# Altium schematic sheet 3_FPGA.SchDoc: AX301  Http://www.heijin.org
size OrCAD A; DocumentNumber: 3; Revision: 1.0; SheetNumber: 3; SheetTotal: 7; PageSetup: Record=PageOptions|CenterHorizontal=True|CenterVertical=True|PrintScale=1.03|XCorrection=1.00|YCorrection=1.00|PrintKind=0|BorderSize=5000000|LeftOffset=0|BottomOffset=0|Orientation=2|PaperLength=1000|PaperWidth=1000|Scale=100|PaperSource=7|PrintQuality=-4|MediaType=1|DitherType=10|PrintScaleMode=1|PaperKind=A4|PaperIndex=9
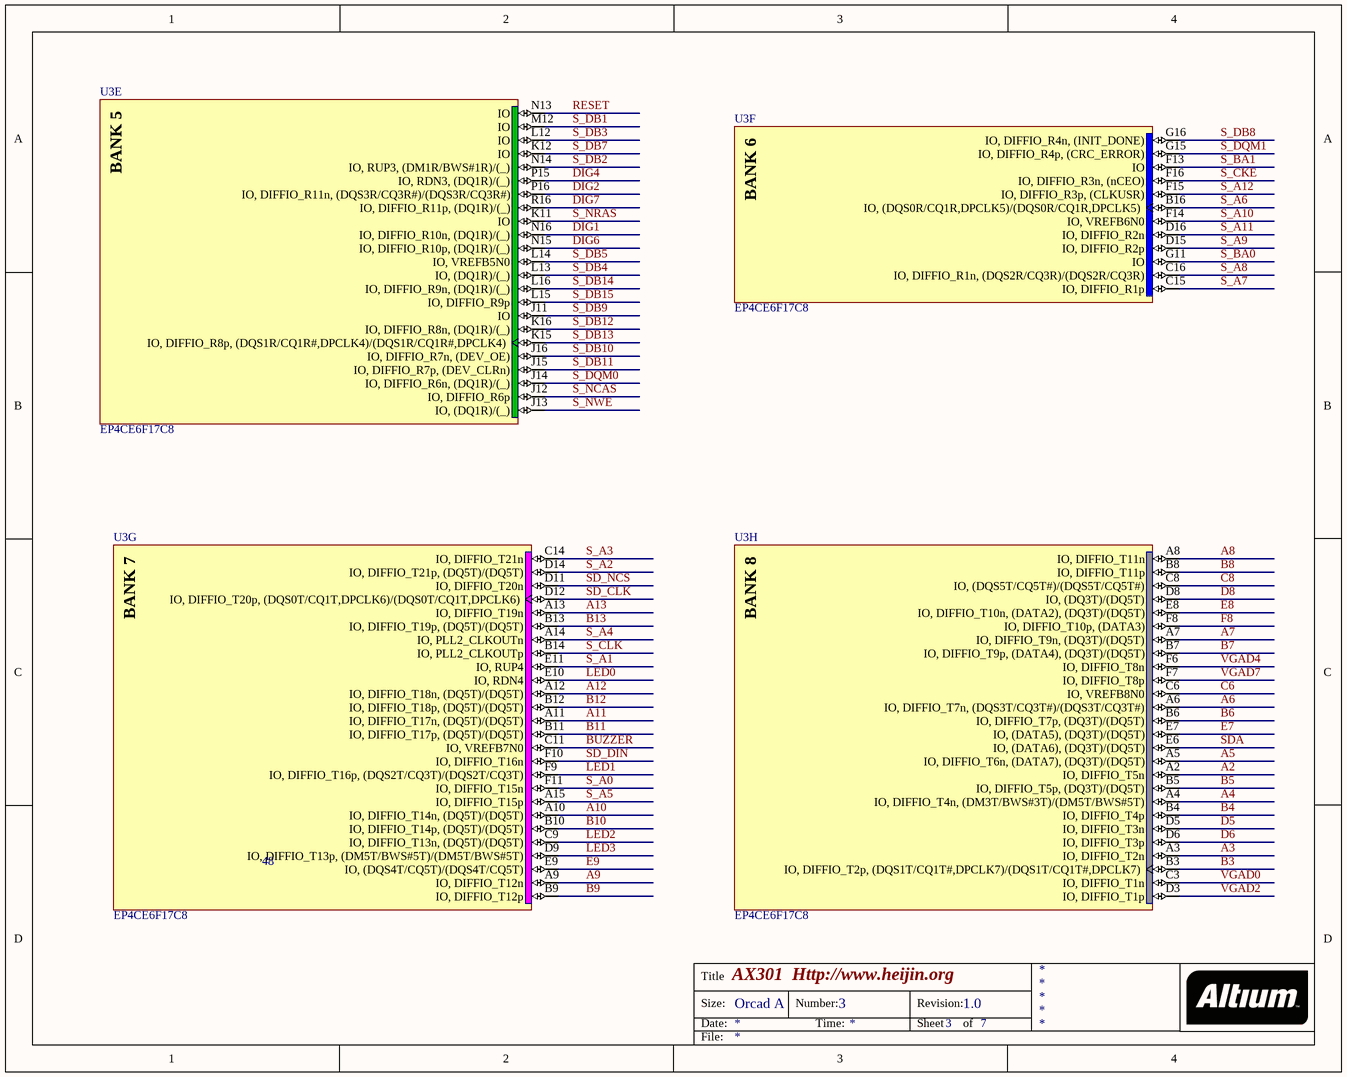
[diagram p0: 3_FPGA.SchDoc]

## Parts
U3  EP4CE6F17C8  [FBGA256]  (parts E,F,G,H of 13)

## Nets
A2: U3.A2(IO,_DIFFIO_T5n)
A3: U3.A3(IO,_DIFFIO_T2n)
A4: U3.A4(IO,_DIFFIO_T4n,_(DM3T/BWS#3T)/(DM5T/BWS#5T))
A5: U3.A5(IO,_DIFFIO_T6n,_(DATA7),_(DQ3T)/(DQ5T))
A6: U3.A6(IO,_DIFFIO_T7n,_(DQS3T/CQ3T#)/(DQS3T/CQ3T#))
A7: U3.A7(IO,_DIFFIO_T9n,_(DQ3T)/(DQ5T))
A8: U3.A8(IO,_DIFFIO_T11n)
A9: U3.A9(IO,_DIFFIO_T12n)
A10: U3.A10(IO,_DIFFIO_T14n,_(DQ5T)/(DQ5T))
A11: U3.A11(IO,_DIFFIO_T17n,_(DQ5T)/(DQ5T))
A12: U3.A12(IO,_DIFFIO_T18n,_(DQ5T)/(DQ5T))
A13: U3.A13(IO,_DIFFIO_T19n)
B3: U3.B3(IO,_DIFFIO_T2p,_(DQS1T/CQ1T#,DPCLK7)/(DQS1T/CQ1T#,DPCLK7))
B4: U3.B4(IO,_DIFFIO_T4p)
B5: U3.B5(IO,_DIFFIO_T5p,_(DQ3T)/(DQ5T))
B6: U3.B6(IO,_DIFFIO_T7p,_(DQ3T)/(DQ5T))
B7: U3.B7(IO,_DIFFIO_T9p,_(DATA4),_(DQ3T)/(DQ5T))
B8: U3.B8(IO,_DIFFIO_T11p)
B9: U3.B9(IO,_DIFFIO_T12p)
B10: U3.B10(IO,_DIFFIO_T14p,_(DQ5T)/(DQ5T))
B11: U3.B11(IO,_DIFFIO_T17p,_(DQ5T)/(DQ5T))
B12: U3.B12(IO,_DIFFIO_T18p,_(DQ5T)/(DQ5T))
B13: U3.B13(IO,_DIFFIO_T19p,_(DQ5T)/(DQ5T))
BUZZER: U3.C11(IO,_VREFB7N0)
C6: U3.C6(IO,_VREFB8N0)
C8: U3.C8(IO,_(DQS5T/CQ5T#)/(DQS5T/CQ5T#))
D5: U3.D5(IO,_DIFFIO_T3n)
D6: U3.D6(IO,_DIFFIO_T3p)
D8: U3.D8(IO,_(DQ3T)/(DQ5T))
DIG1: U3.N16(IO,_DIFFIO_R10n,_(DQ1R)/(_))
DIG2: U3.P16(IO,_DIFFIO_R11n,_(DQS3R/CQ3R#)/(DQS3R/CQ3R#))
DIG4: U3.P15(IO,_RDN3,_(DQ1R)/(_))
DIG6: U3.N15(IO,_DIFFIO_R10p,_(DQ1R)/(_))
DIG7: U3.R16(IO,_DIFFIO_R11p,_(DQ1R)/(_))
E7: U3.E7(IO,_(DATA5),_(DQ3T)/(DQ5T))
E8: U3.E8(IO,_DIFFIO_T10n,_(DATA2),_(DQ3T)/(DQ5T))
E9: U3.E9(IO,_(DQS4T/CQ5T)/(DQS4T/CQ5T))
F8: U3.F8(IO,_DIFFIO_T10p,_(DATA3))
LED0: U3.E10(IO,_RDN4)
LED1: U3.F9(IO,_DIFFIO_T16p,_(DQS2T/CQ3T)/(DQS2T/CQ3T))
LED2: U3.C9(IO,_DIFFIO_T13n,_(DQ5T)/(DQ5T))
LED3: U3.D9(IO,_DIFFIO_T13p,_(DM5T/BWS#5T)/(DM5T/BWS#5T))
RESET: U3.N13(IO)
S_A0: U3.F11(IO,_DIFFIO_T15n)
S_A1: U3.E11(IO,_RUP4)
S_A2: U3.D14(IO,_DIFFIO_T21p,_(DQ5T)/(DQ5T))
S_A3: U3.C14(IO,_DIFFIO_T21n)
S_A4: U3.A14(IO,_PLL2_CLKOUTn)
S_A5: U3.A15(IO,_DIFFIO_T15p)
S_A6: U3.B16(IO,_(DQS0R/CQ1R,DPCLK5)/(DQS0R/CQ1R,DPCLK5))
S_A7: U3.C15(IO,_DIFFIO_R1p)
S_A8: U3.C16(IO,_DIFFIO_R1n,_(DQS2R/CQ3R)/(DQS2R/CQ3R))
S_A9: U3.D15(IO,_DIFFIO_R2p)
S_A10: U3.F14(IO,_VREFB6N0)
S_A11: U3.D16(IO,_DIFFIO_R2n)
S_A12: U3.F15(IO,_DIFFIO_R3p,_(CLKUSR))
S_BA0: U3.G11(IO)
S_BA1: U3.F13(IO)
S_CKE: U3.F16(IO,_DIFFIO_R3n,_(nCEO))
S_CLK: U3.B14(IO,_PLL2_CLKOUTp)
S_DB1: U3.M12(IO)
S_DB2: U3.N14(IO,_RUP3,_(DM1R/BWS#1R)/(_))
S_DB3: U3.L12(IO)
S_DB4: U3.L13(IO,_(DQ1R)/(_))
S_DB5: U3.L14(IO,_VREFB5N0)
S_DB7: U3.K12(IO)
S_DB8: U3.G16(IO,_DIFFIO_R4n,_(INIT_DONE))
S_DB9: U3.J11(IO)
S_DB10: U3.J16(IO,_DIFFIO_R7n,_(DEV_OE))
S_DB11: U3.J15(IO,_DIFFIO_R7p,_(DEV_CLRn))
S_DB12: U3.K16(IO,_DIFFIO_R8n,_(DQ1R)/(_))
S_DB13: U3.K15(IO,_DIFFIO_R8p,_(DQS1R/CQ1R#,DPCLK4)/(DQS1R/CQ1R#,DPCLK4))
S_DB14: U3.L16(IO,_DIFFIO_R9n,_(DQ1R)/(_))
S_DB15: U3.L15(IO,_DIFFIO_R9p)
S_DQM0: U3.J14(IO,_DIFFIO_R6n,_(DQ1R)/(_))
S_DQM1: U3.G15(IO,_DIFFIO_R4p,_(CRC_ERROR))
S_NCAS: U3.J12(IO,_DIFFIO_R6p)
S_NRAS: U3.K11(IO)
S_NWE: U3.J13(IO,_(DQ1R)/(_))
SD_CLK: U3.D12(IO,_DIFFIO_T20p,_(DQS0T/CQ1T,DPCLK6)/(DQS0T/CQ1T,DPCLK6))
SD_DIN: U3.F10(IO,_DIFFIO_T16n)
SD_NCS: U3.D11(IO,_DIFFIO_T20n)
SDA: U3.E6(IO,_(DATA6),_(DQ3T)/(DQ5T))
VGAD0: U3.C3(IO,_DIFFIO_T1n)
VGAD2: U3.D3(IO,_DIFFIO_T1p)
VGAD4: U3.F6(IO,_DIFFIO_T8n)
VGAD7: U3.F7(IO,_DIFFIO_T8p)

## Notes on the sheet
- 48
- Title
- Size:
- Date:
- Orcad A
- Number:
- Time:
- Revision:
- Sheet
- of
- File:
- (in symbol EP4CE6F17C8, part E) BANK 5
- (in symbol EP4CE6F17C8, part F) BANK 6
- (in symbol EP4CE6F17C8, part G) BANK 7
- (in symbol EP4CE6F17C8, part H) BANK 8

## Library data of the parts
U3 = EP4CE6F17C8: Cyclone IV Family FPGA, 2V Core, 179 I/O Pins, 2 PLLs, 256-Pin FBGA, Speed Grade 8, Commercial Grade; Published: 3-May-2010; DatasheetVersion: ver1.2, Mar-2010; PackageVersion: ver16.0, Dec-2009; PackageReference: FBGA256; Publisher: Altium Limited; PackageDescription: 256-Ball FineLine Ball Grid Array (FBGA256) - Option 1 - Wire Bond; Supplier 1: Digi-Key; Supplier Part Number 1: EP4CE6F17C8-ND; Code_JEDEC: MS-034-AAF-1; Code_IPC: BGA100P16X16-256; ComponentLink1Description: Manufacturer Link; ComponentLink1URL: http://www.altera.com/; ComponentLink2Description: Handbook; ComponentLink2URL: http://www.altera.com/literature/hb/cyclone-iv/cyclone4-handbook.pdf; ComponentLink3Description: Pinout Specification; ComponentLink3URL: http://www.altera.com/literature/lit-dp.jsp?category=cyc%204&showspreadsheet=y; ComponentLink4Description: Packaging Specification; ComponentLink4URL: http://www.altera.com/literature/ds/dspkg.pdf